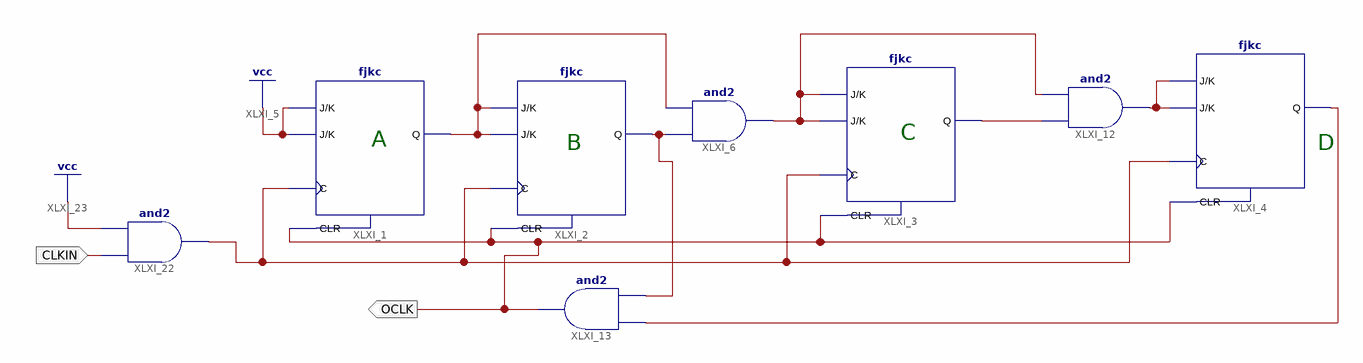
[diagram p0: schematic sheet 1]
// Xilinx ISE schematic Mod100_10.sch (spartan6) as structural Verilog: 8 symbols, 2 ports
module Mod100_10 (
  input  CLKIN,
  output OCLK
);

  wire XLXN_6, XLXN_11, XLXN_13, XLXN_14, XLXN_18, XLXN_19, XLXN_37;

  fjkc XLXI_1 (.C(XLXN_37), .CLR(OCLK), .J(1'b1), .K(1'b1), .Q(XLXN_6));
  fjkc XLXI_2 (.C(XLXN_37), .CLR(OCLK), .J(XLXN_6), .K(XLXN_6), .Q(XLXN_19));
  and XLXI_6 (XLXN_11, XLXN_19, XLXN_6);
  and XLXI_12 (XLXN_14, XLXN_13, XLXN_11);
  fjkc XLXI_4 (.C(XLXN_37), .CLR(OCLK), .J(XLXN_14), .K(XLXN_14), .Q(XLXN_18));
  fjkc XLXI_3 (.C(XLXN_37), .CLR(OCLK), .J(XLXN_11), .K(XLXN_11), .Q(XLXN_13));
  and XLXI_13 (OCLK, XLXN_18, XLXN_19);
  and XLXI_22 (XLXN_37, CLKIN, 1'b1);

  // Notes on the sheet:
  //   C
  //   A
  //   B
  //   D
endmodule
